# Altium project AltiumGitProject.PrjPcb
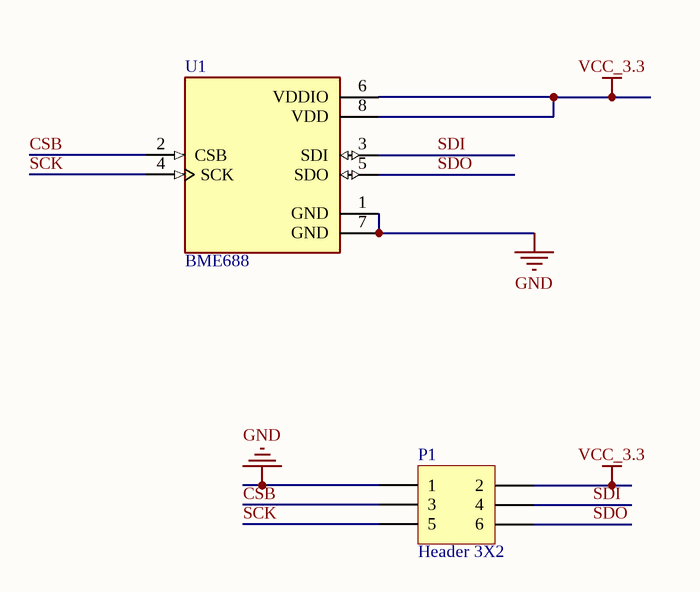
[diagram p0: Sheet1.SchDoc]
1 sheet, 2 parts. Net scope: global (net labels, ports and power ports of the same name join across sheets).
Board file: PCB1.PcbDoc

## Sheet Sheet1.SchDoc
size A; SheetNumber: 1; SheetTotal: 1

### Parts
P1  Header 3X2  [HDR2X3]
U1  BME688  [IC_BME688]

### Nets
GND: P1.1 U1.1(GND) U1.7(GND)
VCC_3.3: P1.2 U1.6(VDDIO) U1.8(VDD)
CSB: P1.3 U1.2(CSB)
SCK: P1.5 U1.4(SCK)
SDI: P1.4 U1.3(SDI)
SDO: P1.6 U1.5(SDO)

### Library data of the parts
P1 = Header 3X2: Header 2x3; LatestRevisionDate: 17-Jul-2002; LatestRevisionNote: Re-released for DXP Platform.; Publisher: Altium Limited
U1 = BME688: Gas sensor measuring relative humidity, barometric pressure, ambient temperature and gas (VOC); MF: {'manufacturer': u'Bosch Sensortec'}; Value: *; Availability: Unavailable; MP: BME688; Price: None; Package: None